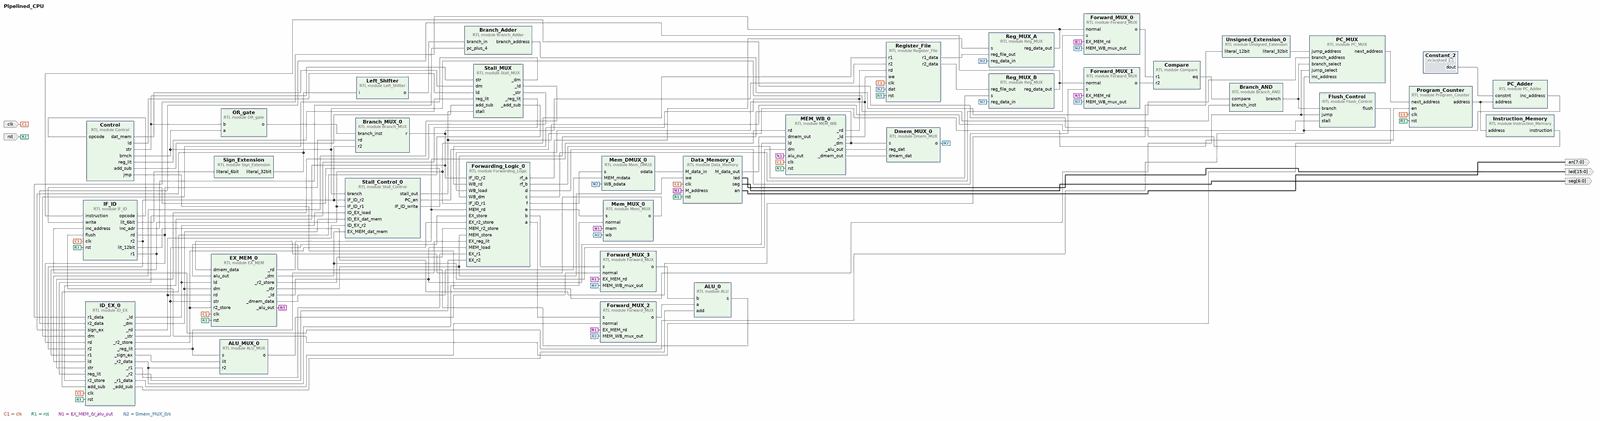
[diagram p0: block diagram of the top level, whole]
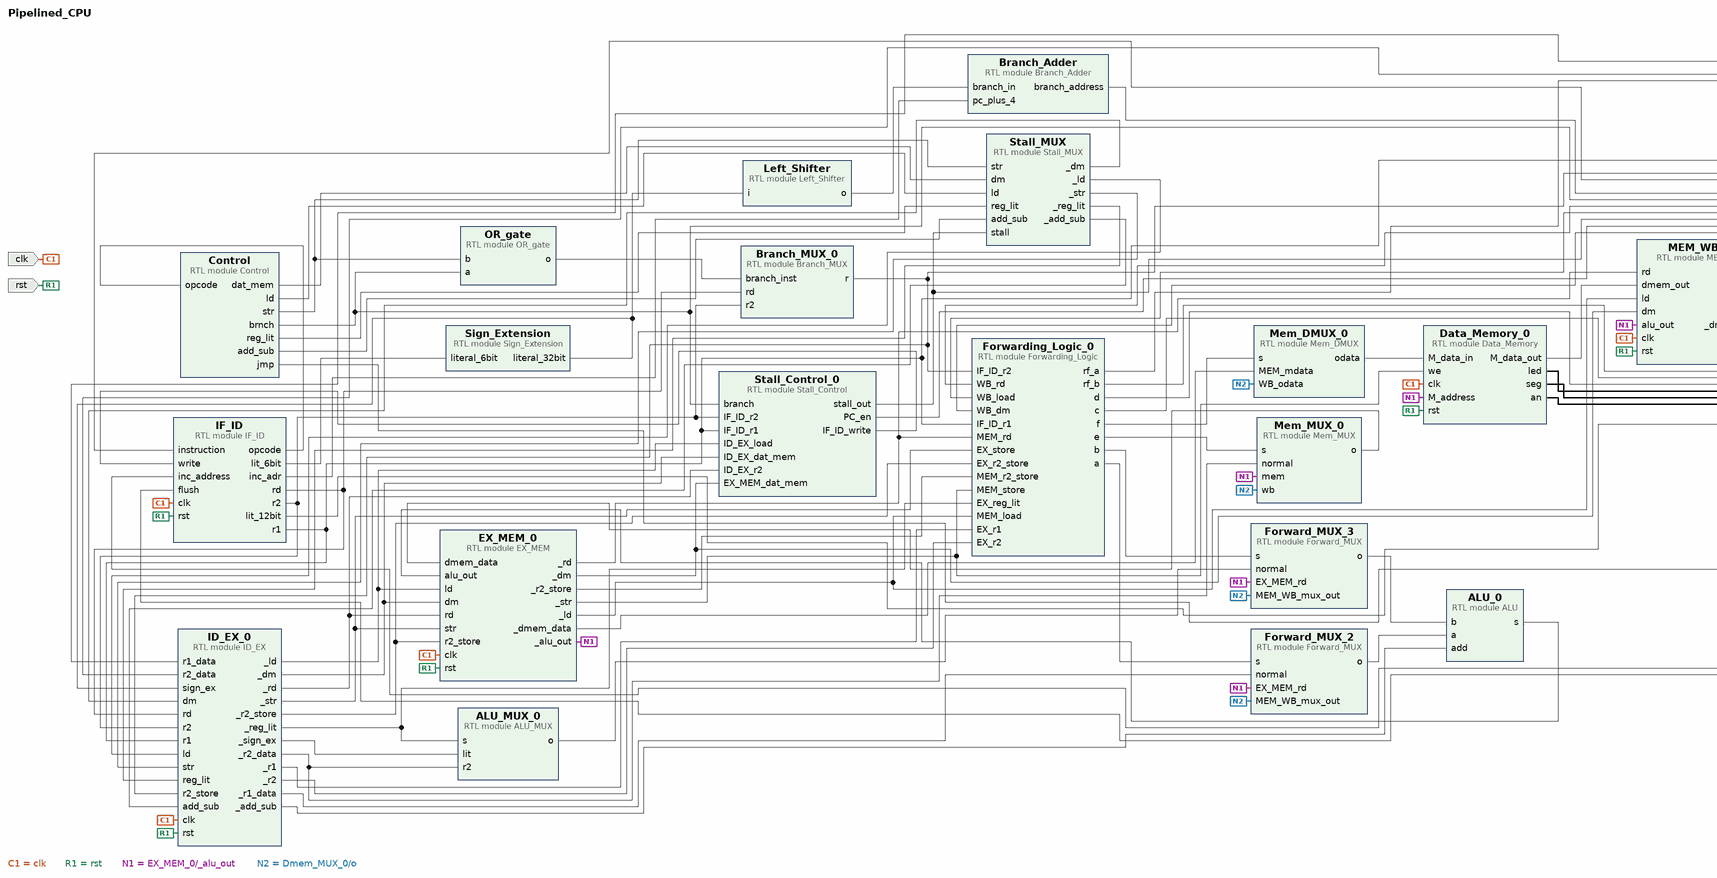
[diagram p1: block diagram of the top level, left part]
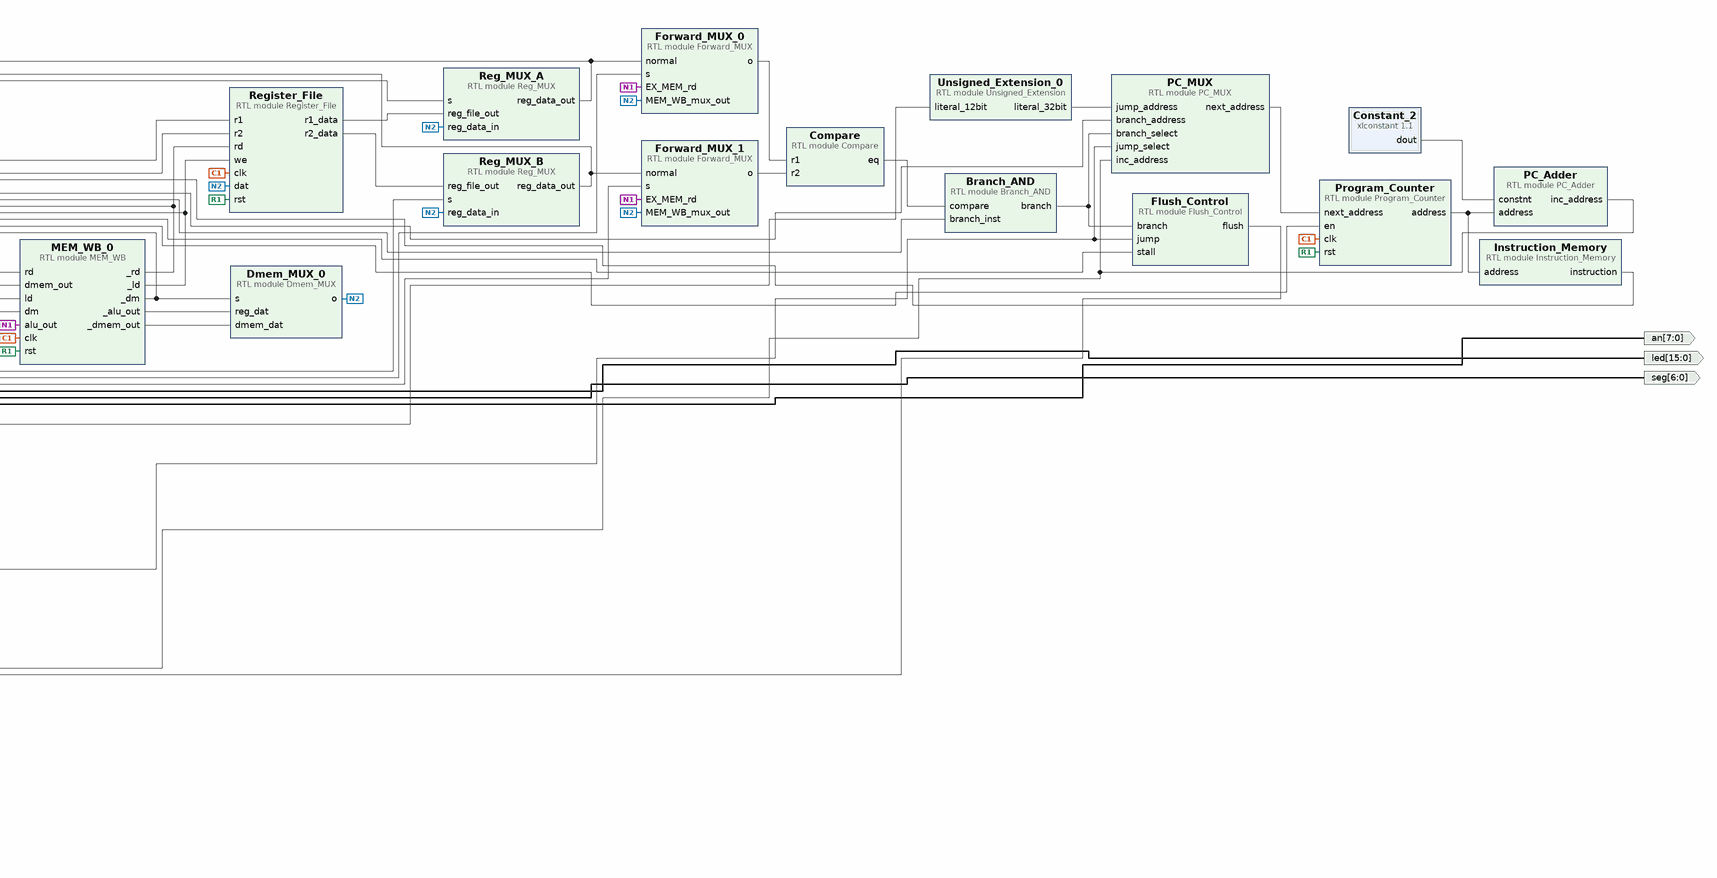
[diagram p2: block diagram of the top level, right part]
# Vivado block design Pipelined_CPU, xc7a35tcpg236-1, Vivado 2017.4
create_bd_design Pipelined_CPU

create_bd_port -dir I -type clk clk
create_bd_port -dir I -type rst rst
create_bd_port -dir O -from 15 -to 0 led
create_bd_port -dir O -from 6 -to 0 seg
create_bd_port -dir O -from 7 -to 0 an

create_bd_cell -type module -reference IF_ID IF_ID
create_bd_cell -type module -reference Program_Counter Program_Counter
create_bd_cell -type module -reference Instruction_Memory Instruction_Memory
create_bd_cell -type module -reference Register_File Register_File
create_bd_cell -type module -reference Unsigned_Extension Unsigned_Extension_0
create_bd_cell -type module -reference Branch_AND Branch_AND
create_bd_cell -type module -reference Forward_MUX Forward_MUX_0
create_bd_cell -type module -reference ALU ALU_0
create_bd_cell -type module -reference Data_Memory Data_Memory_0
set_property -dict [list \
  CONFIG.MEM00_INIT 0x0000000c \
  CONFIG.MEM01_INIT 0x0000000a \
  CONFIG.MEM02_INIT 0x00000010 \
  CONFIG.MEM03_INIT 0x00000002 \
  CONFIG.MEM05_INIT 0x00000006 \
  CONFIG.MEM06_INIT 0x00000008 \
  CONFIG.MEM07_INIT 0x0000000A \
  CONFIG.MEM08_INIT 0x0000000C \
  CONFIG.MEM09_INIT 0x0000000e \
  CONFIG.MEM10_INIT 0x00000010 \
  CONFIG.MEM11_INIT 0x00000012 \
  CONFIG.MEM12_INIT 0x00000014 \
  CONFIG.MEM13_INIT 0x00000000 \
  CONFIG.MEM14_INIT 0x00000000 \
  CONFIG.MEM15_INIT 0x00000000 \
  CONFIG.MEM16_INIT 0x00000000 \
  CONFIG.MEM17_INIT 0x00000000 \
  CONFIG.MEM18_INIT 0x00000000 \
  CONFIG.MEM19_INIT 0x00000000 \
  CONFIG.MEM20_INIT 0x00000000 \
  CONFIG.MEM21_INIT 0x00000000 \
  CONFIG.MEM22_INIT 0x00000000 \
  CONFIG.MEM23_INIT 0x00000000 \
  CONFIG.MEM24_INIT 0x00000000 \
  CONFIG.MEM25_INIT 0x00000000 \
  CONFIG.MEM26_INIT 0x00000000 \
  CONFIG.MEM27_INIT 0x00000000 \
  CONFIG.MEM28_INIT 0x00000000 \
  CONFIG.MEM29_INIT 0x00000000 \
] [get_bd_cells Data_Memory_0]
create_bd_cell -type module -reference Dmem_MUX Dmem_MUX_0
create_bd_cell -type module -reference PC_MUX PC_MUX
create_bd_cell -type module -reference PC_Adder PC_Adder
create_bd_cell -type module -reference Sign_Extension Sign_Extension
create_bd_cell -type module -reference Left_Shifter Left_Shifter
create_bd_cell -type module -reference Branch_Adder Branch_Adder
create_bd_cell -type module -reference Compare Compare
create_bd_cell -type module -reference Branch_MUX Branch_MUX_0
create_bd_cell -type module -reference ALU_MUX ALU_MUX_0
create_bd_cell -type module -reference MEM_WB MEM_WB_0
create_bd_cell -type module -reference Forward_MUX Forward_MUX_1
create_bd_cell -type module -reference Forward_MUX Forward_MUX_2
create_bd_cell -type module -reference Forward_MUX Forward_MUX_3
create_bd_cell -type module -reference Stall_MUX Stall_MUX
create_bd_cell -type module -reference Reg_MUX Reg_MUX_B
create_bd_cell -type module -reference ID_EX ID_EX_0
create_bd_cell -type module -reference Mem_MUX Mem_MUX_0
create_bd_cell -type module -reference Reg_MUX Reg_MUX_A
create_bd_cell -type module -reference OR_gate OR_gate
create_bd_cell -type module -reference EX_MEM EX_MEM_0
create_bd_cell -type module -reference Mem_DMUX Mem_DMUX_0
create_bd_cell -type module -reference Control Control
create_bd_cell -type module -reference Flush_Control Flush_Control
create_bd_cell -type module -reference Stall_Control Stall_Control_0
create_bd_cell -type module -reference Forwarding_Logic Forwarding_Logic_0
create_bd_cell -type ip -vlnv xilinx.com:ip:xlconstant:1.1 Constant_2
set_property -dict {CONFIG.CONST_WIDTH 32 CONFIG.CONST_VAL 2} [get_bd_cells Constant_2]

# ---- connections ----

connect_bd_net -net PC_MUX_0_next_address [get_bd_pins PC_MUX/next_address] [get_bd_pins Program_Counter/next_address]
connect_bd_net [get_bd_ports clk] \
  [get_bd_pins IF_ID/clk] [get_bd_pins Program_Counter/clk] [get_bd_pins Register_File/clk] [get_bd_pins Data_Memory_0/clk] \
  [get_bd_pins MEM_WB_0/clk] [get_bd_pins ID_EX_0/clk] [get_bd_pins EX_MEM_0/clk]
connect_bd_net [get_bd_ports rst] \
  [get_bd_pins IF_ID/rst] [get_bd_pins Program_Counter/rst] [get_bd_pins Register_File/rst] [get_bd_pins Data_Memory_0/rst] \
  [get_bd_pins MEM_WB_0/rst] [get_bd_pins ID_EX_0/rst] [get_bd_pins EX_MEM_0/rst]
connect_bd_net [get_bd_pins Program_Counter/address] [get_bd_pins Instruction_Memory/address] [get_bd_pins PC_Adder/address]
connect_bd_net [get_bd_pins Constant_2/dout] [get_bd_pins PC_Adder/constnt]
connect_bd_net [get_bd_pins Instruction_Memory/instruction] [get_bd_pins IF_ID/instruction]
connect_bd_net [get_bd_pins IF_ID/rd] [get_bd_pins Branch_MUX_0/rd] [get_bd_pins ID_EX_0/rd]
connect_bd_net [get_bd_pins IF_ID/r2] [get_bd_pins Branch_MUX_0/r2] [get_bd_pins ID_EX_0/r2] [get_bd_pins Stall_Control_0/IF_ID_r2]
connect_bd_net [get_bd_pins IF_ID/r1] \
  [get_bd_pins Register_File/r1] [get_bd_pins ID_EX_0/r1] [get_bd_pins Stall_Control_0/IF_ID_r1] \
  [get_bd_pins Forwarding_Logic_0/IF_ID_r1]
connect_bd_net [get_bd_pins IF_ID/opcode] [get_bd_pins Control/opcode]
connect_bd_net -net IF_ID_lit [get_bd_pins IF_ID/lit_6bit] [get_bd_pins Sign_Extension/literal_6bit]
connect_bd_net -net Sign_Extension_0_literal_32bit [get_bd_pins Sign_Extension/literal_32bit] \
  [get_bd_pins Left_Shifter/i] [get_bd_pins ID_EX_0/sign_ex]
connect_bd_net [get_bd_pins IF_ID/inc_adr] [get_bd_pins Branch_Adder/pc_plus_4]
connect_bd_net [get_bd_pins Left_Shifter/o] [get_bd_pins Branch_Adder/branch_in]
connect_bd_net -net Branch_Adder_0_branch_address [get_bd_pins Branch_Adder/branch_address] [get_bd_pins PC_MUX/branch_address]
connect_bd_net -net Register_File_r1_data [get_bd_pins Reg_MUX_A/reg_data_out] [get_bd_pins Forward_MUX_0/normal] [get_bd_pins ID_EX_0/r1_data]
connect_bd_net -net Register_File_r2_data [get_bd_pins Reg_MUX_B/reg_data_out] [get_bd_pins Forward_MUX_1/normal] [get_bd_pins ID_EX_0/r2_data]
connect_bd_net [get_bd_pins IF_ID/lit_12bit] [get_bd_pins Unsigned_Extension_0/literal_12bit]
connect_bd_net [get_bd_pins Unsigned_Extension_0/literal_32bit] [get_bd_pins PC_MUX/jump_address]
connect_bd_net [get_bd_pins Control/dat_mem] [get_bd_pins Stall_MUX/dm]
connect_bd_net [get_bd_pins Control/ld] [get_bd_pins Stall_MUX/ld]
connect_bd_net [get_bd_pins Control/str] [get_bd_pins Stall_MUX/str] [get_bd_pins OR_gate/b]
connect_bd_net [get_bd_pins Control/brnch] [get_bd_pins Branch_AND/branch_inst] [get_bd_pins OR_gate/a] [get_bd_pins Stall_Control_0/branch]
connect_bd_net [get_bd_pins Control/jmp] [get_bd_pins PC_MUX/jump_select] [get_bd_pins Flush_Control/jump]
connect_bd_net [get_bd_pins Control/reg_lit] [get_bd_pins Stall_MUX/reg_lit]
connect_bd_net [get_bd_pins Control/add_sub] [get_bd_pins Stall_MUX/add_sub]
connect_bd_net -net Stall_MUX_0__dm [get_bd_pins Stall_MUX/_dm] [get_bd_pins ID_EX_0/dm]
connect_bd_net -net Stall_MUX_0__ld [get_bd_pins Stall_MUX/_ld] [get_bd_pins ID_EX_0/ld]
connect_bd_net -net Stall_MUX_0__str [get_bd_pins Stall_MUX/_str] [get_bd_pins ID_EX_0/str]
connect_bd_net -net Stall_MUX_0__reg_lit [get_bd_pins Stall_MUX/_reg_lit] [get_bd_pins ID_EX_0/reg_lit]
connect_bd_net -net Stall_MUX_0__add_sub [get_bd_pins Stall_MUX/_add_sub] [get_bd_pins ID_EX_0/add_sub]
connect_bd_net [get_bd_pins Branch_MUX_0/r] [get_bd_pins Register_File/r2] [get_bd_pins ID_EX_0/r2_store] [get_bd_pins Forwarding_Logic_0/IF_ID_r2]
connect_bd_net [get_bd_pins PC_Adder/inc_address] [get_bd_pins IF_ID/inc_address] [get_bd_pins PC_MUX/inc_address]
connect_bd_net -net Flush_Control_0_flush [get_bd_pins Flush_Control/flush] [get_bd_pins IF_ID/flush]
connect_bd_net -net Branch_AND_0_branch [get_bd_pins Branch_AND/branch] [get_bd_pins PC_MUX/branch_select] [get_bd_pins Flush_Control/branch]
connect_bd_net [get_bd_pins Compare/eq] [get_bd_pins Branch_AND/compare]
connect_bd_net [get_bd_pins Stall_Control_0/stall_out] [get_bd_pins Stall_MUX/stall] [get_bd_pins Flush_Control/stall]
connect_bd_net [get_bd_pins Stall_Control_0/IF_ID_write] [get_bd_pins IF_ID/write]
connect_bd_net [get_bd_pins Stall_Control_0/PC_en] [get_bd_pins Program_Counter/en]
connect_bd_net [get_bd_pins ID_EX_0/_ld] [get_bd_pins EX_MEM_0/ld] [get_bd_pins Stall_Control_0/ID_EX_load]
connect_bd_net [get_bd_pins ID_EX_0/_dm] [get_bd_pins EX_MEM_0/dm] [get_bd_pins Stall_Control_0/ID_EX_dat_mem]
connect_bd_net [get_bd_pins ID_EX_0/_r2_data] [get_bd_pins ALU_MUX_0/r2] [get_bd_pins Mem_MUX_0/normal]
connect_bd_net [get_bd_pins Forward_MUX_1/o] [get_bd_pins Compare/r2]
connect_bd_net [get_bd_pins Forward_MUX_0/o] [get_bd_pins Compare/r1]
connect_bd_net [get_bd_pins ID_EX_0/_r1_data] [get_bd_pins Forward_MUX_2/normal]
connect_bd_net [get_bd_pins Forward_MUX_2/o] [get_bd_pins ALU_0/a]
connect_bd_net [get_bd_pins Forward_MUX_3/o] [get_bd_pins ALU_0/b]
connect_bd_net [get_bd_pins ID_EX_0/_add_sub] [get_bd_pins ALU_0/add]
connect_bd_net [get_bd_pins ID_EX_0/_sign_ex] [get_bd_pins ALU_MUX_0/lit]
connect_bd_net [get_bd_pins ALU_MUX_0/o] [get_bd_pins Forward_MUX_3/normal]
connect_bd_net [get_bd_pins ID_EX_0/_reg_lit] [get_bd_pins ALU_MUX_0/s] [get_bd_pins Forwarding_Logic_0/EX_reg_lit]
connect_bd_net [get_bd_pins Forwarding_Logic_0/a] [get_bd_pins Forward_MUX_2/s]
connect_bd_net [get_bd_pins Forwarding_Logic_0/b] [get_bd_pins Forward_MUX_3/s]
connect_bd_net [get_bd_pins ID_EX_0/_r1] [get_bd_pins Forwarding_Logic_0/EX_r1]
connect_bd_net [get_bd_pins ID_EX_0/_r2] [get_bd_pins Forwarding_Logic_0/EX_r2]
connect_bd_net [get_bd_pins ID_EX_0/_str] [get_bd_pins EX_MEM_0/str] [get_bd_pins Forwarding_Logic_0/EX_store]
connect_bd_net [get_bd_pins ALU_0/s] [get_bd_pins EX_MEM_0/alu_out]
connect_bd_net [get_bd_pins ID_EX_0/_rd] [get_bd_pins EX_MEM_0/rd] [get_bd_pins Stall_Control_0/ID_EX_r2]
connect_bd_net [get_bd_pins EX_MEM_0/_rd] [get_bd_pins MEM_WB_0/rd] [get_bd_pins Forwarding_Logic_0/MEM_rd]
connect_bd_net [get_bd_pins EX_MEM_0/_ld] [get_bd_pins MEM_WB_0/ld] [get_bd_pins Forwarding_Logic_0/MEM_load]
connect_bd_net [get_bd_pins EX_MEM_0/_str] [get_bd_pins Data_Memory_0/we] [get_bd_pins Forwarding_Logic_0/MEM_store]
connect_bd_net [get_bd_pins EX_MEM_0/_alu_out] \
  [get_bd_pins Forward_MUX_0/EX_MEM_rd] [get_bd_pins Data_Memory_0/M_address] [get_bd_pins MEM_WB_0/alu_out] \
  [get_bd_pins Forward_MUX_1/EX_MEM_rd] [get_bd_pins Forward_MUX_2/EX_MEM_rd] [get_bd_pins Forward_MUX_3/EX_MEM_rd] \
  [get_bd_pins Mem_MUX_0/mem]
connect_bd_net [get_bd_pins EX_MEM_0/_dm] [get_bd_pins MEM_WB_0/dm] [get_bd_pins Stall_Control_0/EX_MEM_dat_mem]
connect_bd_net [get_bd_pins Data_Memory_0/M_data_out] [get_bd_pins MEM_WB_0/dmem_out]
connect_bd_net [get_bd_pins MEM_WB_0/_rd] [get_bd_pins Register_File/rd] [get_bd_pins Forwarding_Logic_0/WB_rd]
connect_bd_net [get_bd_pins MEM_WB_0/_ld] [get_bd_pins Register_File/we] [get_bd_pins Forwarding_Logic_0/WB_load]
connect_bd_net [get_bd_pins MEM_WB_0/_dm] [get_bd_pins Dmem_MUX_0/s] [get_bd_pins Forwarding_Logic_0/WB_dm]
connect_bd_net [get_bd_pins MEM_WB_0/_alu_out] [get_bd_pins Dmem_MUX_0/reg_dat]
connect_bd_net [get_bd_pins MEM_WB_0/_dmem_out] [get_bd_pins Dmem_MUX_0/dmem_dat]
connect_bd_net [get_bd_pins Dmem_MUX_0/o] \
  [get_bd_pins Register_File/dat] [get_bd_pins Forward_MUX_0/MEM_WB_mux_out] [get_bd_pins Forward_MUX_1/MEM_WB_mux_out] \
  [get_bd_pins Forward_MUX_2/MEM_WB_mux_out] [get_bd_pins Forward_MUX_3/MEM_WB_mux_out] [get_bd_pins Reg_MUX_B/reg_data_in] \
  [get_bd_pins Mem_MUX_0/wb] [get_bd_pins Reg_MUX_A/reg_data_in] [get_bd_pins Mem_DMUX_0/WB_odata]
connect_bd_net [get_bd_pins Register_File/r1_data] [get_bd_pins Reg_MUX_A/reg_file_out]
connect_bd_net [get_bd_pins Register_File/r2_data] [get_bd_pins Reg_MUX_B/reg_file_out]
connect_bd_net [get_bd_pins Forwarding_Logic_0/rf_a] [get_bd_pins Reg_MUX_A/s]
connect_bd_net [get_bd_pins Forwarding_Logic_0/rf_b] [get_bd_pins Reg_MUX_B/s]
connect_bd_net [get_bd_pins OR_gate/o] [get_bd_pins Branch_MUX_0/branch_inst]
connect_bd_net [get_bd_pins Forwarding_Logic_0/d] [get_bd_pins Forward_MUX_1/s]
connect_bd_net [get_bd_pins Forwarding_Logic_0/c] [get_bd_pins Forward_MUX_0/s]
connect_bd_net [get_bd_pins ID_EX_0/_r2_store] [get_bd_pins EX_MEM_0/r2_store] [get_bd_pins Forwarding_Logic_0/EX_r2_store]
connect_bd_net [get_bd_pins Mem_MUX_0/o] [get_bd_pins EX_MEM_0/dmem_data]
connect_bd_net [get_bd_pins Forwarding_Logic_0/e] [get_bd_pins Mem_MUX_0/s]
connect_bd_net [get_bd_pins Data_Memory_0/led] [get_bd_ports led]
connect_bd_net [get_bd_pins Data_Memory_0/seg] [get_bd_ports seg]
connect_bd_net [get_bd_pins Data_Memory_0/an] [get_bd_ports an]
connect_bd_net [get_bd_pins EX_MEM_0/_dmem_data] [get_bd_pins Mem_DMUX_0/MEM_mdata]
connect_bd_net [get_bd_pins Mem_DMUX_0/odata] [get_bd_pins Data_Memory_0/M_data_in]
connect_bd_net [get_bd_pins EX_MEM_0/_r2_store] [get_bd_pins Forwarding_Logic_0/MEM_r2_store]
connect_bd_net [get_bd_pins Forwarding_Logic_0/f] [get_bd_pins Mem_DMUX_0/s]

validate_bd_design
save_bd_design
